# Altium schematic sheet THM_Block.SchDoc
size A4; SheetNumber: 2; SheetTotal: 16
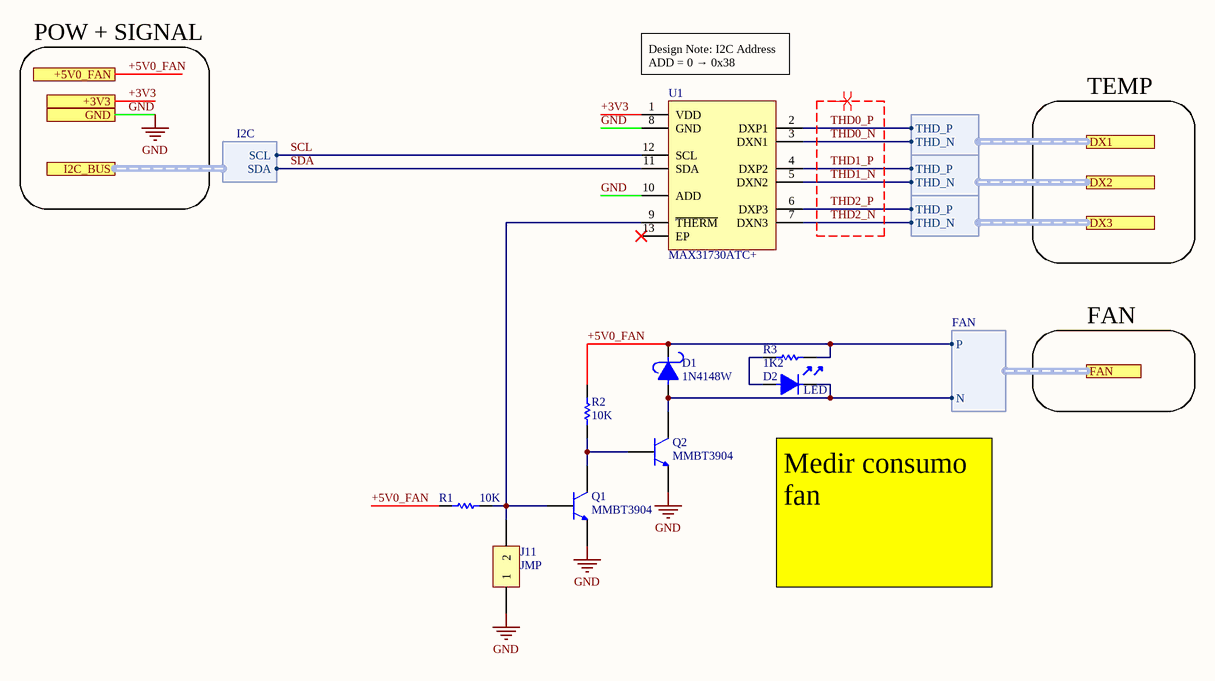
[diagram p0: THM_Block.SchDoc]

## Parts
D1  1N4148W  [SOD-123]
D2  LED  [LED-0805]
J11  JMP  [SIP1X2]
Q1  MMBT3904  [VS-SOT-23]
Q2  MMBT3904  [VS-SOT-23]
R1  10K  [0402-RES-PANASONIC]
R2  10K  [0402-RES-PANASONIC]
R3  1K2  [0402-RES-PANASONIC]
U1  MAX31730ATC+  [MAX31730ATC+]

## Ports
+3V3 (see AudioDSP-v3.1.1_top[5C], ADC_Block[1A], ADC_Interface[1A], CLK_Block[1B], CTRL_Connectors[1A], DSP_Block[1A], DSP_Interface[1A], MCU_Block[1A], POW_Block[4B]), +5V0_FAN, DX1 (harness THD, see AudioDSP-v3.1.1_top[5C]), DX2 (harness THD, see AudioDSP-v3.1.1_top[5C]), DX3 (harness THD, see AudioDSP-v3.1.1_top[5C]), FAN (harness FAN, see AudioDSP-v3.1.1_top[6C], OUT_Connectors[3D]), GND (see AudioDSP-v3.1.1_top[5C], ADC_Block[1B], ADC_Interface[1A], CLK_Block[1B], CTRL_Connectors[1A], DAC_Block[1B], DAC_Interface[1B], DSP_Block[1A], DSP_Interface[1A], IN_Connectors[3A], LPF_Block[1B], LPF_Interface[1B], MCU_Block[1B], OUT_Connectors[3B], POW_Block[1A]), I2C_BUS (harness I2C, see AudioDSP-v3.1.1_top[5C], ADC_Block[1B])

## Harnesses
I2C: SCL, SDA
THD: THD_N, THD_P
FAN: P, N

## Nets
GND: J11.1 Q1.2(E) Q2.2(E) U1.8(GND) U1.10(ADD) ; port GND
+3V3: U1.1(VDD) ; port +3V3
+5V0_FAN: D1.2 R1.2 R2.1 R3.2 ; port +5V0_FAN, port FAN.P
SCL: U1.12(SCL) ; port I2C_BUS.SCL
SDA: U1.11(SDA) ; port I2C_BUS.SDA
THD0_N: U1.3(DXN1) ; port DX1.THD_N
THD0_P: U1.2(DXP1) ; port DX1.THD_P
THD1_N: U1.5(DXN2) ; port DX2.THD_N
THD1_P: U1.4(DXP2) ; port DX2.THD_P
THD2_N: U1.7(DXN3) ; port DX3.THD_N
THD2_P: U1.6(DXP3) ; port DX3.THD_P
NetD1_1: D1.1 D2.2 Q2.3(C) ; port FAN.N
NetD2_1: D2.1 R3.1
NetJ11_2: J11.2 Q1.1(B) R1.1 U1.9(~{THERM})
NetQ1_3: Q1.3(C) Q2.1(B) R2.2

Not connected (* = marked no-connect by the designer): U1 13(EP)*

## Layout directives
differential pair: THD0_N, THD0_P, THD1_N, THD1_P, THD2_N, THD2_P

## Notes on the sheet
- POW + SIGNAL
- (near U1) Design Note: I2C Address
  ADD = 0 → 0x38
- TEMP
- FAN
- Medir consumo fan

## Library data of the parts
D1 = 1N4148W: 100V 500mW Single 1.25V@150mA 4ns 150mA SOD-123  Switching Diode; JLCPart: C2099
D2 = LED-SMD: JLCPart: C84256
J11 = CON1X2
Q1 Q2 = MMBT3904: Bipolar (BJT) Transistor NPN 40 V 200 mA 300MHz 350 mW Surface Mount SOT-23; Digikey_PN: 5272-MMBT3904CT-ND; JLCPart: C20526
R1-R3 = RES-SMD
  R1 R2: JLCPart: C25744
  R3: JLCPart: C25862
U1 = MAX31730ATC+: Temperature Sensor Digital, Local/Remote 11 b 12-TDFN (3x3)